# EAGLE schematic AD590 (EAGLE 6.5.0)
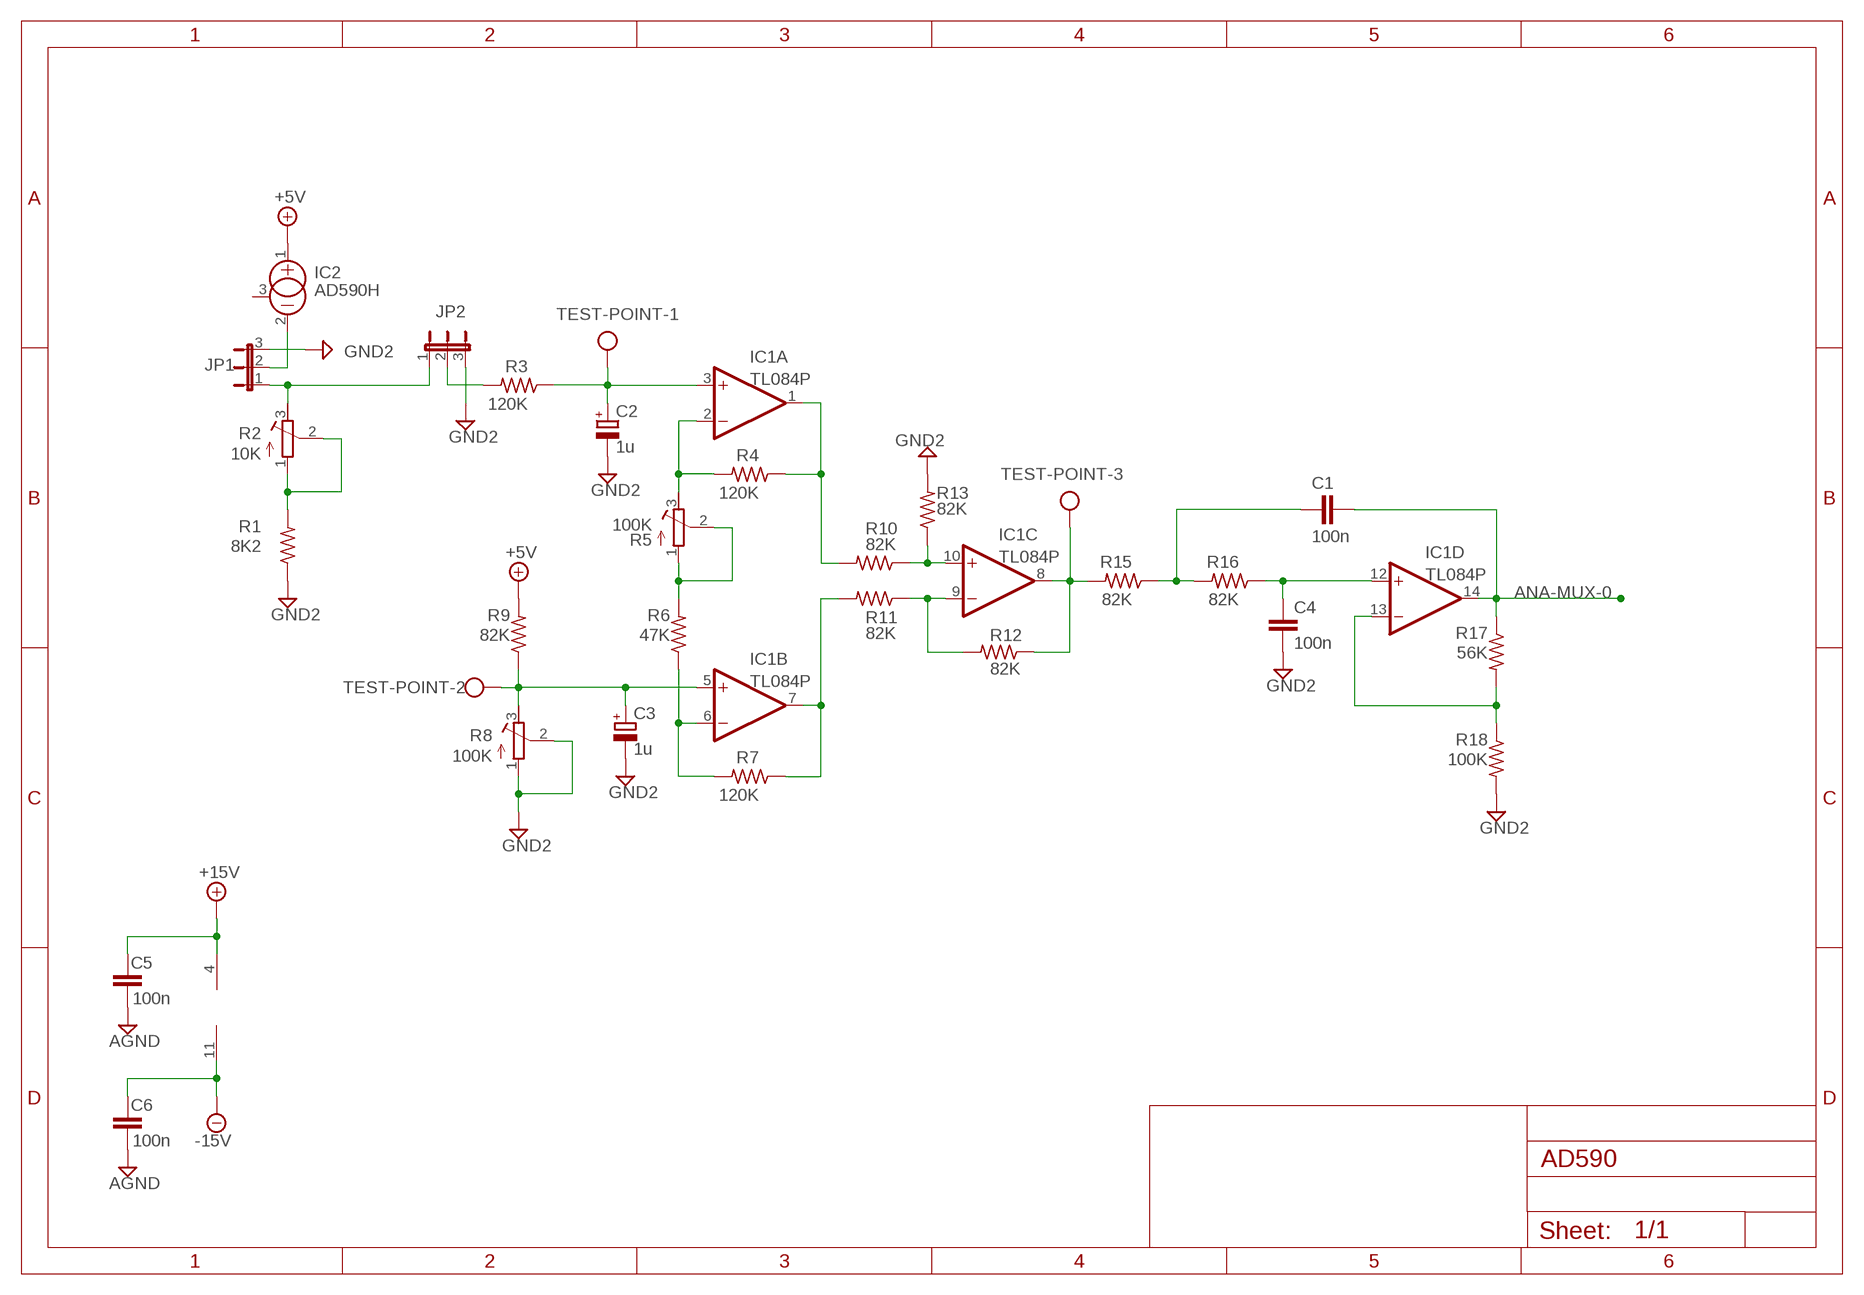
[diagram p0: schematic, sheet 1]

## Parts
C1  100n  C-EU025-024X044  [C025-024X044]
C2  1u  CPOL-EUB45181C  [B45181C]
C3  1u  CPOL-EUB45181C  [B45181C]
C4  100n  C-EU025-024X044  [C025-024X044]
C5  100n  C-EU025-024X044  [C025-024X044]
C6  100n  C-EU025-024X044  [C025-024X044]
IC1  TL084P  [DIL14]
IC2  AD590H  [TO18]
JP1  JP2E  [JP2]
JP2  JP2E  [JP2]
R1  8K2  R-US_0204/7  [0204/7]
R2  10K  R-TRIMM64W  [RTRIM64W]
R3  120K  R-US_0204/7  [0204/7]
R4  120K  R-US_0204/7  [0204/7]
R5  100K  R-TRIMM64W  [RTRIM64W]
R6  47K  R-US_0204/7  [0204/7]
R7  120K  R-US_0204/7  [0204/7]
R8  100K  R-TRIMM64W  [RTRIM64W]
R9  82K  R-US_0204/7  [0204/7]
R10  82K  R-US_0204/7  [0204/7]
R11  82K  R-US_0204/7  [0204/7]
R12  82K  R-US_0204/7  [0204/7]
R13  82K  R-US_0204/7  [0204/7]
R15  82K  R-US_0204/7  [0204/7]
R16  82K  R-US_0204/7  [0204/7]
R17  56K  R-US_0204/7  [0204/7]
R18  100K  R-US_0204/7  [0204/7]
TEST-POINT  W237-103  [W237-103]

## Nets
+5V: IC2.1(+) R9.2
+15V: C5.2 IC1.4(P:V+)
-15V: C6.2 IC1.11(P:V-)
AGND: C5.1 C6.1
ANA-MUX-0: C1.2 IC1.14(D:OUT) R17.1
GND2: C2.- C3.- C4.1 JP1.3 JP2.3 R1.1 R8.1(E) R8.2(S) R13.2 R18.2
N$1: R1.2 R2.1(E) R2.2(S)
N$2: IC2.2(-) JP1.2
N$3: R5.1(E) R5.2(S) R6.2
N$4: C2.+ IC1.3(A:+IN) R3.1 TEST-POINT.1
N$5: IC1.2(A:-IN) R4.2 R5.3(A)
N$6: IC1.1(A:OUT) R4.1 R10.2
N$7: JP2.2 R3.2
N$8: JP1.1 JP2.1 R2.3(A)
N$9: C3.+ IC1.5(B:+IN) R8.3(A) R9.1 TEST-POINT.2
N$10: IC1.6(B:-IN) R6.1 R7.2
N$11: IC1.7(B:OUT) R7.1 R11.2
N$12: IC1.10(C:+IN) R10.1 R13.1
N$13: IC1.9(C:-IN) R11.1 R12.2
N$14: IC1.8(C:OUT) R12.1 R15.2 TEST-POINT.3
N$16: C1.1 R15.1 R16.2
N$17: C4.2 IC1.12(D:+IN) R16.1
N$18: IC1.13(D:-IN) R17.2 R18.1
Unconnected: IC2.3(CAN)

## Library data of the parts
C1 C4-C6 = rcl:C-EU: CAPACITOR, European symbol
C2 C3 = rcl:CPOL-EU: POLARIZED CAPACITOR, European symbol
IC1 = linear:TL084: OP AMP
IC2 = linear:AD590H: TEMPERATURE SENSOR current output
JP1 JP2 = jumper:JP2E: JUMPER
R1 R3 R4 R6 R7 R9-R13 R15-R18 = rcl:R-US_: RESISTOR, American symbol
R2 R5 R8 = resistor:R-TRIMM: Trimm resistor
TEST-POINT = con-wago-500:W237-103: WAGO SCREW CLAMP; MPN: 237-103; OC_FARNELL: unknown; OC_NEWARK: 18M7116